# EAGLE design controlador automação granja (EAGLE 7.5.0)
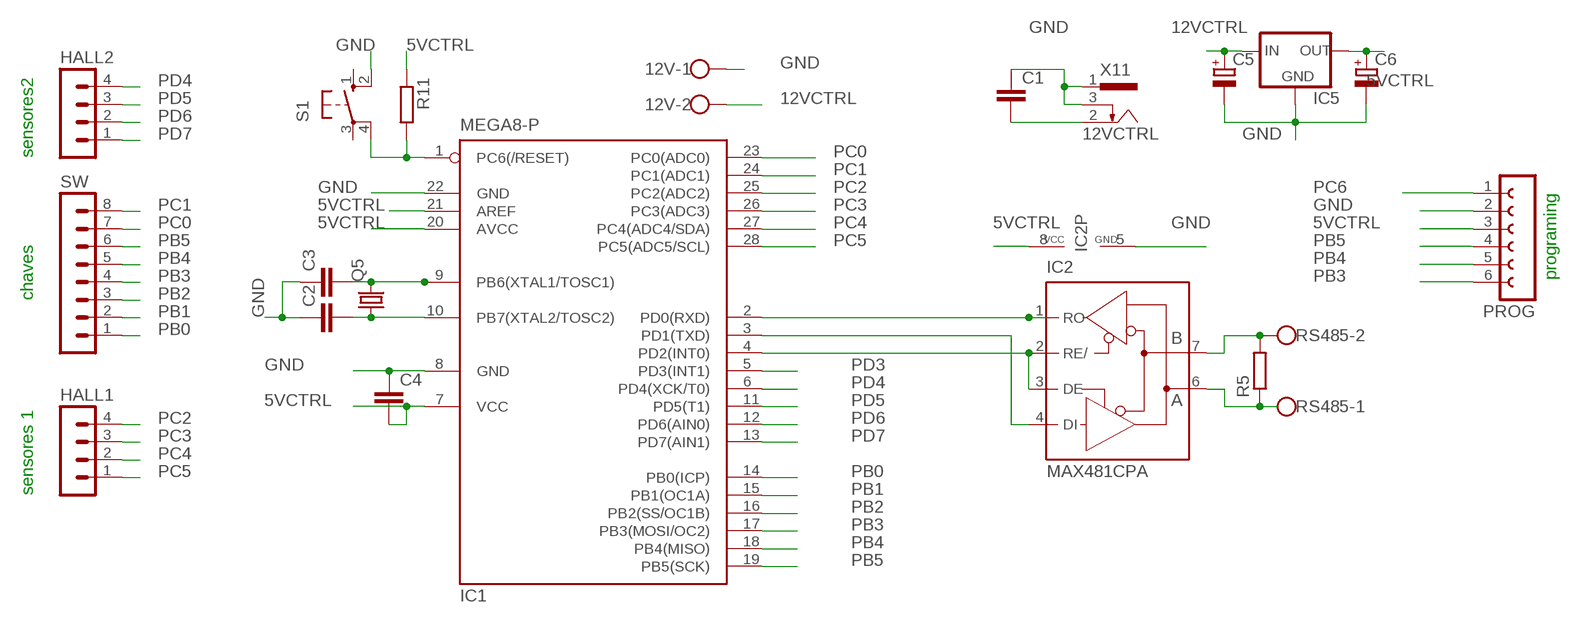
[diagram p0: schematic, sheet 1]

## Parts
12V  W237-102  [W237-102]
C1  C-EU050-025X075  [C050-025X075]
C2  C-EU050-025X075  [C050-025X075]
C3  C-EU050-024X044  [C050-024X044]
C4  C-EU050-024X044  [C050-024X044]
C5  CPOL-EUE1.8-4  [E1,8-4]
C6  CPOL-EUE1.8-4  [E1,8-4]
HALL1  MA04-1  [MA04-1]
HALL2  MA04-1  [MA04-1]
IC1  MEGA8-P  [DIL28-3]
IC2  MAX481CPA  [DIL08]
IC5  78LXX  [78LXX]
PROG  FE06-1  [FE06]
Q5  CRYSTALHC49S  [HC49/S]
R5  R-EU_0207/7  [0207/7]
R11  R-EU_0207/7  [0207/7]
RS485  W237-102  [W237-102]
S1  10-XX  [B3F-10XX]
SW  MA08-1  [MA08-1]
X11  733980-62  [733980-62]

## Nets
5VCTRL: C4.2 C6.+ IC1.7(VCC) IC1.20(AVCC) IC1.21(AREF) IC2.8(VCC) IC5.OUT PROG.3 R11.1
12VCTRL: 12V.2 C1.2 C5.+ IC5.IN X11.2
GND: 12V.1 C1.1 C2.1 C3.1 C4.1 C5.- C6.- IC1.8(GND) IC1.22(GND) IC2.5(GND) IC5.GND PROG.2 S1.2(S1) X11.1 X11.3
N$13: IC2.7(B) R5.2 RS485.2
N$35: IC2.6(A) R5.1 RS485.1
N$43: C2.2 IC1.10(PB7(XTAL2/TOSC2)) Q5.1
N$44: C3.2 IC1.9(PB6(XTAL1/TOSC1)) Q5.2
N$54: IC1.2(PD0(RXD)) IC2.1(RO)
N$55: IC1.3(PD1(TXD)) IC2.4(DI)
N$56: IC1.4(PD2(INT0)) IC2.2(RE/) IC2.3(DE)
PB0: IC1.14(PB0(ICP)) SW.1
PB1: IC1.15(PB1(OC1A)) SW.2
PB2: IC1.16(PB2(SS/OC1B)) SW.3
PB3: IC1.17(PB3(MOSI/OC2)) PROG.6 SW.4
PB4: IC1.18(PB4(MISO)) PROG.5 SW.5
PB5: IC1.19(PB5(SCK)) PROG.4 SW.6
PC0: IC1.23(PC0(ADC0)) SW.7
PC1: IC1.24(PC1(ADC1)) SW.8
PC2: HALL1.4 IC1.25(PC2(ADC2))
PC3: HALL1.3 IC1.26(PC3(ADC3))
PC4: HALL1.2 IC1.27(PC4(ADC4/SDA))
PC5: HALL1.1 IC1.28(PC5(ADC5/SCL))
PC6: IC1.1(PC6(/RESET)) PROG.1 R11.2 S1.4(P1)
PD3: IC1.5(PD3(INT1))
PD4: HALL2.4 IC1.6(PD4(XCK/T0))
PD5: HALL2.3 IC1.11(PD5(T1))
PD6: HALL2.2 IC1.12(PD6(AIN0))
PD7: HALL2.1 IC1.13(PD7(AIN1))
Unconnected: S1.1(S) S1.3(P)

## Notes on the sheet
- sensores2
- programing
- chaves
- sensores 1

## Library data of the parts
12V RS485 = con-wago-500:W237-102: WAGO SCREW CLAMP; MPN: 237-102; OC_FARNELL: unknown; OC_NEWARK: 70K9898
C1-C3 = rcl:C-EU: CAPACITOR, European symbol
C4 = resistor:C-EU: CAPACITOR, European symbol
C5 C6 = resistor:CPOL-EU: POLARIZED CAPACITOR, European symbol
HALL1 HALL2 = con-lstb:MA04-1: PIN HEADER; OC_FARNELL: unknown; OC_NEWARK: unknown
IC1 = atmel:MEGA8-P: MICROCONTROLLER 8 Kbytes FLASH, 1 kbytes SRAM, 512 bytes EEPROM, USART, 4-channel 10 bit ADC, 2-channel 8 bit ADC Pin compatible with Atmega48, ATMega88, ATMega168 Source: avr.lbr; OC_FARNELL: unknown; OC_NEWARK: unknown
IC2 = maxim:MAX481CPA: RS485 TRANSEIVER; MPN: MAX481CPA+; OC_FARNELL: unknown; OC_NEWARK: 99K3445
IC5 = v-reg:78LXX: VOLTAGE REGULATOR
PROG = con-lsta:FE06-1: FEMALE HEADER; OC_FARNELL: unknown; OC_NEWARK: unknown
Q5 = crystal:CRYSTAL: CRYSTAL; OC_FARNELL: 1667008; OC_NEWARK: unknown
R5 R11 = rcl:R-EU_: RESISTOR, European symbol
S1 = switch-omron:10-XX: OMRON SWITCH; MPN: B3F-1000; OC_FARNELL: 176432; OC_NEWARK: 36M3542
SW = con-lstb:MA08-1: PIN HEADER; OC_FARNELL: unknown; OC_NEWARK: unknown
X11 = con-conrad:73398?: FEMALE PRINT CONNECTOR Niedervolt-Steckverbinder Distributor Conrad

## Board
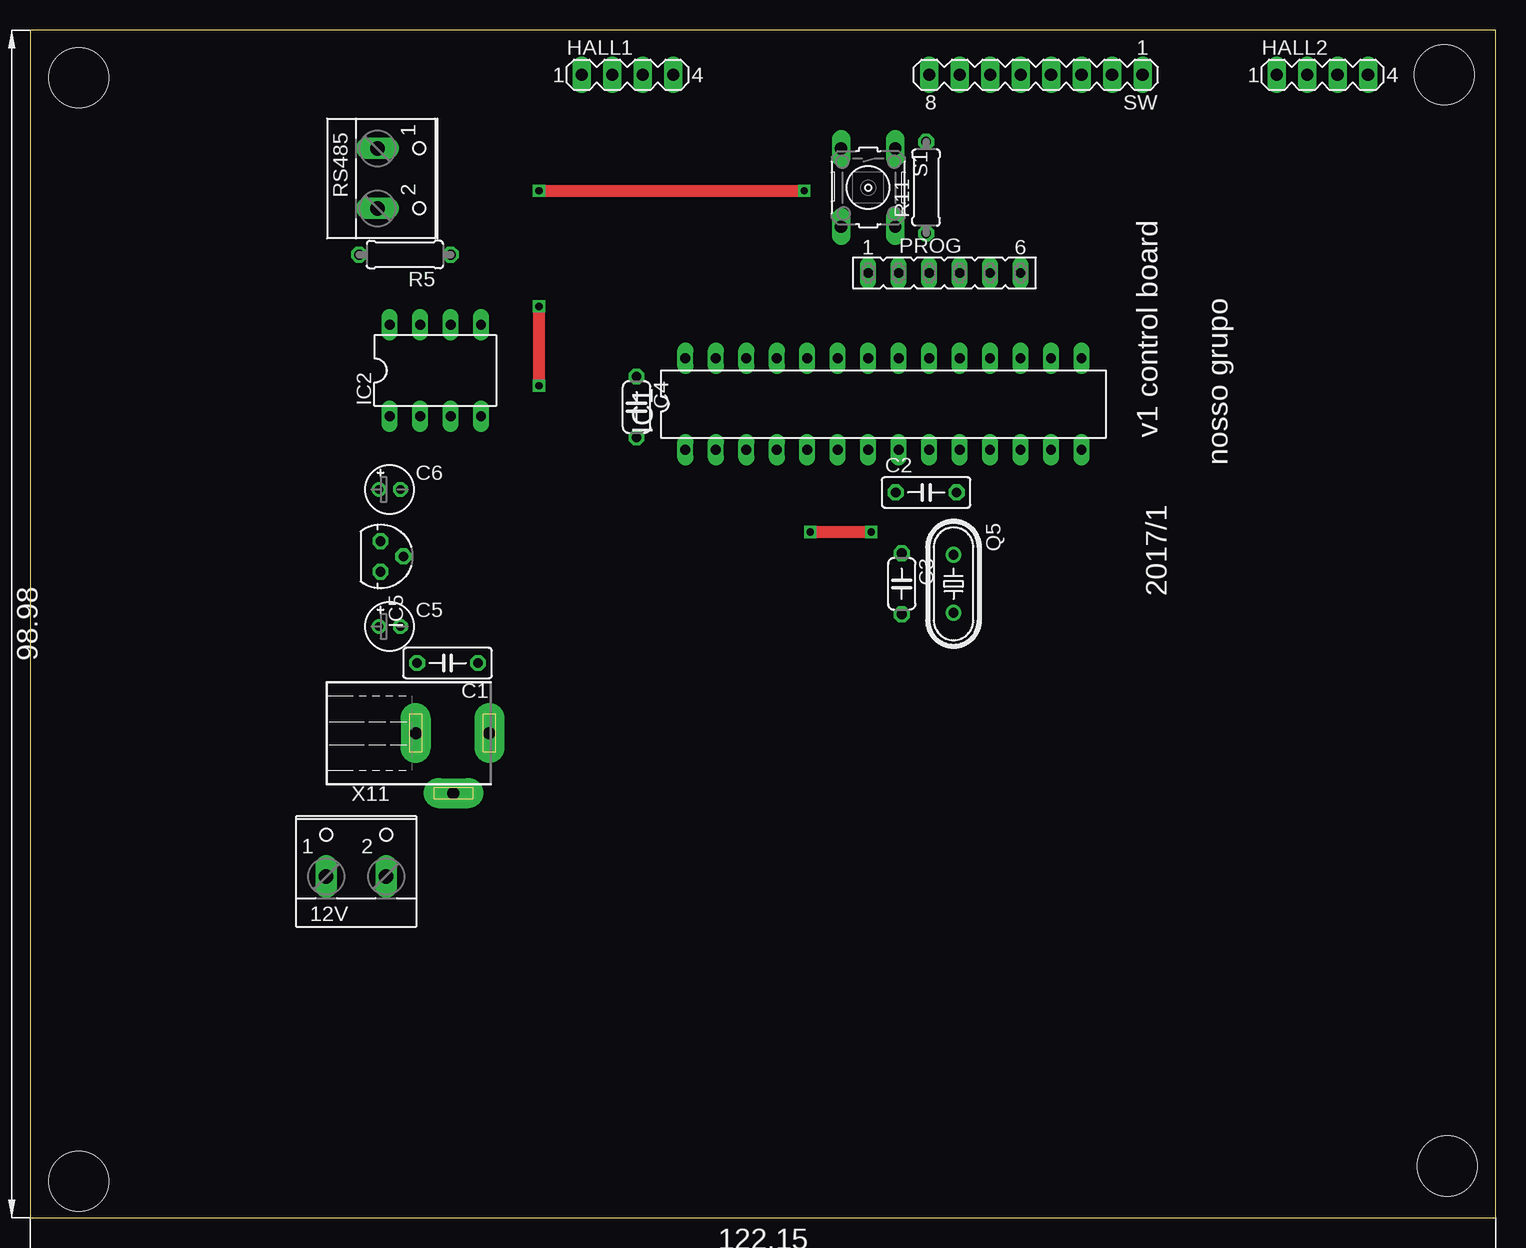
[diagram p1: board, top side]
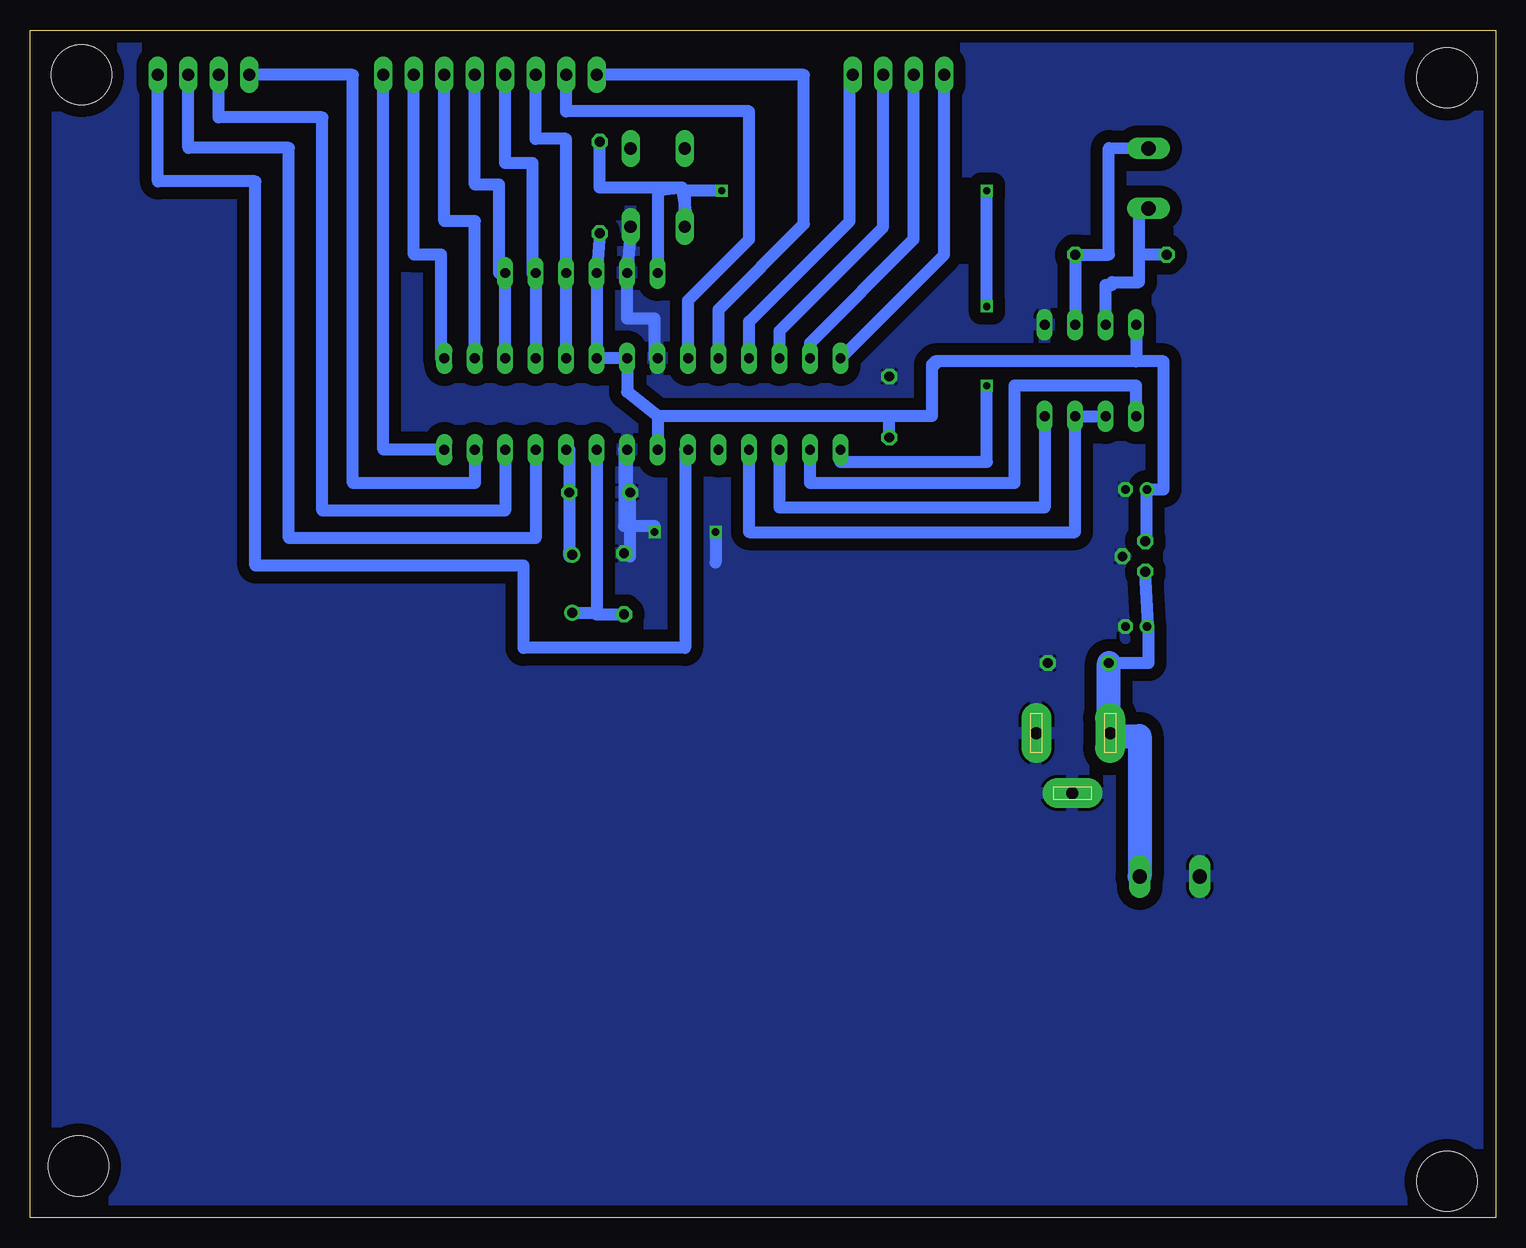
[diagram p2: board, bottom side, seen from below]

Size 122.15 x 98.98 mm. Coordinates in mm from the lower left corner, seen from the top.
Outline: 0,0 122.15,0 122.15,98.98 0,98.98 0,0
Copper layers (1*16): Top 0.035mm / dielectric 1.5mm / Bottom 0.035mm
Design rules "default": minimum track width 10mil, minimum drill 24mil, track to track 8mil, track to pad 8mil, pad to pad 8mil, via to via 8mil, smd to smd 8mil, copper to edge 40mil, drill to drill 8mil, minimum pad ring 10mil, minimum via ring 8mil, stop-mask expansion 4mil, vias tented up to drill 0mil, thermal gap 10mil
Holes 5 mm at 4.06,95 117.86,95.25 118.11,4.32 4.06,3.05

### Footprints (pad centres in the part's own frame; a part is rotated, then mirrored left to right if it is on the bottom)
W237-102 = drill 1.194 long: 1 -2.5,-1.27; 2 2.5,-1.27
C050-025X075 = drill 0.813 octagon: 1 -2.54,0; 2 2.54,0
C050-024X044 = drill 0.813 octagon: 1 -2.54,0; 2 2.54,0
E1,8-4 = drill 0.711 pad 1.168: + -0.889,0 | drill 0.711 pad 1.168 octagon: - 0.889,0
MA04-1 = drill 1.016 long: 1 -3.81,0; 2 -1.27,0; 3 1.27,0; 4 3.81,0
DIL28-3 = drill 0.813 long: 1 -16.51,-3.81; 2 -13.97,-3.81; 3 -11.43,-3.81; 4 -8.89,-3.81; 5 -6.35,-3.81; 6 -3.81,-3.81; 7 -1.27,-3.81; 8 1.27,-3.81; 9 3.81,-3.81; 10 6.35,-3.81; 11 8.89,-3.81; 12 11.43,-3.81; 13 13.97,-3.81; 14 16.51,-3.81; 15 16.51,3.81; 16 13.97,3.81; 17 11.43,3.81; 18 8.89,3.81; 19 6.35,3.81; 20 3.81,3.81; 21 1.27,3.81; 22 -1.27,3.81; 23 -3.81,3.81; 24 -6.35,3.81; 25 -8.89,3.81; 26 -11.43,3.81; 27 -13.97,3.81; 28 -16.51,3.81
DIL08 = drill 0.813 long: 1 -3.81,-3.81; 2 -1.27,-3.81; 3 1.27,-3.81; 4 3.81,-3.81; 5 3.81,3.81; 6 1.27,3.81; 7 -1.27,3.81; 8 -3.81,3.81
78LXX = drill 0.813 octagon: GND 0,1.905; IN 1.27,0; OUT -1.27,0
FE06 = drill 0.813 long: 1 -6.35,0; 2 -3.81,0; 3 -1.27,0; 4 1.27,0; 5 3.81,0; 6 6.35,0
HC49/S = drill 0.813: 1 -2.413,0; 2 2.413,0
0207/7 = drill 0.813 octagon: 1 -3.81,0; 2 3.81,0
B3F-10XX = drill 1.016 long: 1 -3.251,2.261; 2 3.251,2.261; 3 -3.251,-2.261; 4 3.251,-2.261
MA08-1 = drill 1.016 long: 1 -8.89,0; 2 -6.35,0; 3 -3.81,0; 4 -1.27,0; 5 1.27,0; 6 3.81,0; 7 6.35,0; 8 8.89,0
733980-62 = drill 1 pad 2.5 long: 1 0,8.57; 2 0,2.42; 3 5,5.57

### Placement (x,y rotation side)
12V  27.18,29.72 0 top
C1  34.8,46.23 180 top
C2  74.68,60.45 0 top
C3  72.64,52.83 270 top
C4  50.55,67.56 270 top
C5  29.97,49.28 0 top
C6  29.97,60.71 0 top
HALL1  49.78,95.25 0 top
HALL2  107.7,95.25 0 top
IC1  71.12,67.82 0 top
IC2  33.78,70.61 0 top
IC5  29.21,55.12 270 top
PROG  76.2,78.74 0 top
Q5  76.96,52.83 270 top
R5  31.24,80.26 180 top
R11  74.68,85.85 90 top
RS485  30.23,86.61 270 top
S1  69.85,85.85 270 top
SW  83.82,95.25 180 top
X11  29.72,40.39 270 top

### Tracks (layer width: path | path; a pad name or v marks a point on that pad's centre or on a via)
5VCTRL
  Bottom 1: 69.85,66.8 72.39,68.83 IC1.21 IC1.20 PROG.3 R11.1 | 69.85,66.8 IC1.7 | C4.2 50.55,66.8 | 50.55,66.8 69.85,66.8 | IC2.8 29.97,71.37 | 29.97,71.37 46.74,71.37 46.74,71.12 46.99,71.12 46.99,66.8 50.55,66.8 | IC5.OUT 29.08,56.39 C6.+ 27.69,60.71 27.69,71.37 29.97,71.37
12VCTRL
  Bottom 1: 28.96,49.28 IC5.IN | C5.+ 28.96,49.28 | 28.96,49.28 28.96,46.23 C1.2
  Bottom 2: X11.2 31.75,40.39 32.26,40.13 | 32.26,40.13 C1.2 | 32.26,40.13 29.68,40.13 12V.2
GND  (via drill 0.6)
  Top 1: v70.1,57.15 v65.02,57.15
  Bottom 1: IC1.22 70.1,71.63 70.1,74.93 72.39,74.93 PROG.2 72.14,82.09 S1.2 | C3.1 72.14,55.12 C2.1 72.39,60.45 IC1.8 72.64,64.01 72.64,57.66 70.1,57.66 v70.1,57.15 | v65.02,57.15 65.02,54.61
  pour Bottom (isolate 1): 3.05,99.06 119.89,98.04 119.89,-2.03 0,-1.52 0,99.06
N$13
  Bottom 1: 29.72,80.26 29.72,84.07 RS485.2 | R5.2 29.72,80.26 | 29.72,80.26 29.72,77.98 32,77.98 32,77.72 32.51,77.72 IC2.7
N$35
  Bottom 1: RS485.1 32.26,89.15 32.26,80.26 R5.1 IC2.6
N$43
  Bottom 1: IC1.10 77.22,64.01 C2.2 77.22,55.63 | 77.22,55.12 77.22,55.63 | 77.22,55.63 Q5.1
N$44
  Bottom 1: Q5.2 74.93,50.42 | C3.2 74.93,50.29 74.93,50.42 | IC1.9 74.93,50.42
N$54
  Bottom 1: IC2.1 29.97,69.34 40.13,69.34 40.13,61.21 57.15,61.21 IC1.2
N$55
  Bottom 1: IC1.3 59.69,59.18 37.59,59.18 IC2.4
N$56
  Bottom 1: IC1.4 62.23,57.15 35.05,57.15 IC2.3 IC2.2
PB0
  Bottom 1: IC1.14 92.71,64.01 SW.1
PB1
  Bottom 1: IC1.15 87.88,71.63 87.88,80.26 90.17,80.26 SW.2
PB2
  Bottom 1: IC1.16 85.09,83.06 87.63,83.06 SW.3
PB3
  Bottom 1: IC1.17 PROG.6 83.06,78.74 83.06,86.11 85.09,86.11 SW.4
PB4
  Bottom 1: IC1.18 PROG.5 80.26,78.74 80.26,87.88 82.55,87.88 SW.5
PB5
  Bottom 1: IC1.19 PROG.4 77.47,89.92 80.01,89.92 SW.6
PC0
  Bottom 1: IC1.23 67.31,76.45 62.23,81.53 62.23,92.2 77.47,92.2 SW.7
PC1
  Bottom 1: IC1.24 64.77,75.69 57.66,82.8 57.66,95.25 SW.8
PC2
  Bottom 1: IC1.25 62.23,74.68 53.85,83.06 53.85,95 HALL1.4
PC3
  Bottom 1: IC1.26 59.69,73.91 51.05,82.55 HALL1.3
PC4
  Bottom 1: IC1.27 57.15,72.9 48.51,81.53 HALL1.2
PC5
  Bottom 1: IC1.28 45.97,80.26 HALL1.1
PC6  (via drill 0.6)
  Top 1: v42.42,69.34 v42.42,75.95 | v42.42,85.6 v64.52,85.6
  Bottom 1: 67.57,84.58 S1.4 67.31,82.85 67.82,85.85 | 67.57,84.58 67.56,85.39 67.82,85.85 | 67.82,85.85 69.85,85.6 PROG.1 69.85,78.49 | 67.82,85.85 74.68,85.85 R11.2 | IC1.1 54.61,62.99 42.42,62.99 v42.42,69.34 | v42.42,75.95 v42.42,85.6 | v64.52,85.6 67.57,85.6 67.57,84.58
PD4
  Bottom 1: IC1.6 67.56,64.01 67.56,47.5 81.03,47.5 81.03,54.36 103.38,54.36 103.38,86.36 111.51,86.36 HALL2.4
PD5
  Bottom 1: IC1.11 80.01,56.64 100.58,56.64 100.58,89.15 108.97,89.15 HALL2.3
PD6
  Bottom 1: IC1.12 82.55,58.93 97.79,58.93 97.79,91.69 106.43,91.69 HALL2.2
PD7
  Bottom 1: IC1.13 85.09,61.21 95.25,61.21 95.25,95.25 HALL2.1

### Text on the board
tNames: v1 control board | nosso grupo | 2017/1